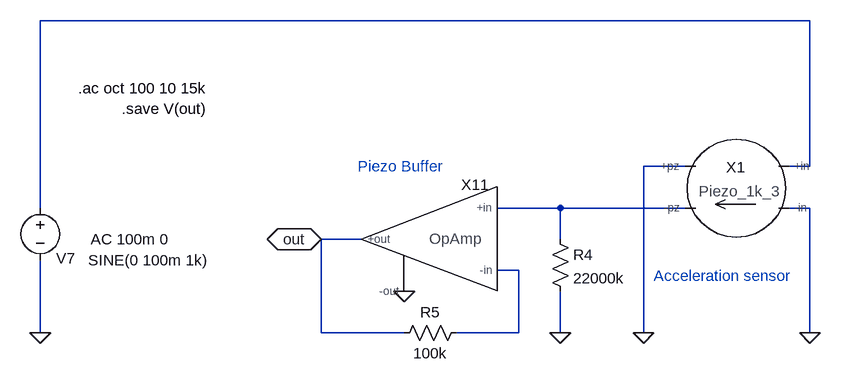
[diagram p0: schematic Piezo_1k_3 Test.asc]
Piezo_1k_3 Test.asc, the LTspice schematic file:
Version 4
SHEET 1 880 680
WIRE -14752 -4144 -15936 -4144
WIRE -14944 -3920 -15008 -3920
WIRE -14752 -3920 -14752 -4144
WIRE -14752 -3920 -14784 -3920
WIRE -15936 -3856 -15936 -4144
WIRE -15136 -3856 -15232 -3856
WIRE -14944 -3856 -15136 -3856
WIRE -14752 -3856 -14784 -3856
WIRE -15440 -3808 -15504 -3808
WIRE -15136 -3808 -15136 -3856
WIRE -15200 -3760 -15232 -3760
WIRE -15936 -3664 -15936 -3776
WIRE -15504 -3664 -15504 -3808
WIRE -15376 -3664 -15504 -3664
WIRE -15200 -3664 -15200 -3760
WIRE -15200 -3664 -15296 -3664
WIRE -15136 -3664 -15136 -3728
WIRE -15008 -3664 -15008 -3920
WIRE -14752 -3664 -14752 -3856
FLAG -15936 -3664 0
FLAG -15136 -3664 0
FLAG -15504 -3808 out
IOPIN -15504 -3808 BiDir
FLAG -15376 -3728 0
FLAG -14752 -3664 0
FLAG -15008 -3664 0
SYMBOL voltage -15936 -3872 M0
WINDOW 123 -198 64 Left 0
WINDOW 39 0 0 Left 0
WINDOW 0 -54 93 Left 0
WINDOW 3 -259 96 Left 0
SYMATTR Value2 AC 100m 0
SYMATTR InstName V7
SYMATTR Value SINE(0 100m 1k)
SYMBOL res -15152 -3824 R0
SYMATTR InstName R4
SYMATTR Value 22000k
SYMBOL res -15280 -3680 R90
WINDOW 0 0 56 VBottom 0
WINDOW 3 32 56 VTop 0
SYMATTR InstName R5
SYMATTR Value 100k
SYMBOL OpAmp -15328 -3808 M0
SYMATTR InstName X11
SYMBOL Piezo_1k_3 -14896 -3904 M0
SYMATTR InstName X1
TEXT -15680 -4040 Right 0 !.ac oct 100 10 15k\n.save V(out)
TEXT -15448 -3920 Left 0 ;Piezo Buffer
TEXT -14992 -3752 Left 0 ;Acceleration sensor

The netlist it stands for:
* Piezo_1k_3 Test.asc
V7 N001 0 SINE(0 100m 1k) AC 100m 0
R4 N002 0 22000k
R5 N003 out 100k
XX11 N003 0 out N002 OpAmp  ; pins -in -out +out +in
XX1 N001 0 0 N002 Piezo_1k_3  ; pins +in +pz -in -pz
.ac oct 100 10 15k
.save V(out)
* Piezo Buffer
* Acceleration sensor
.backanno
.end